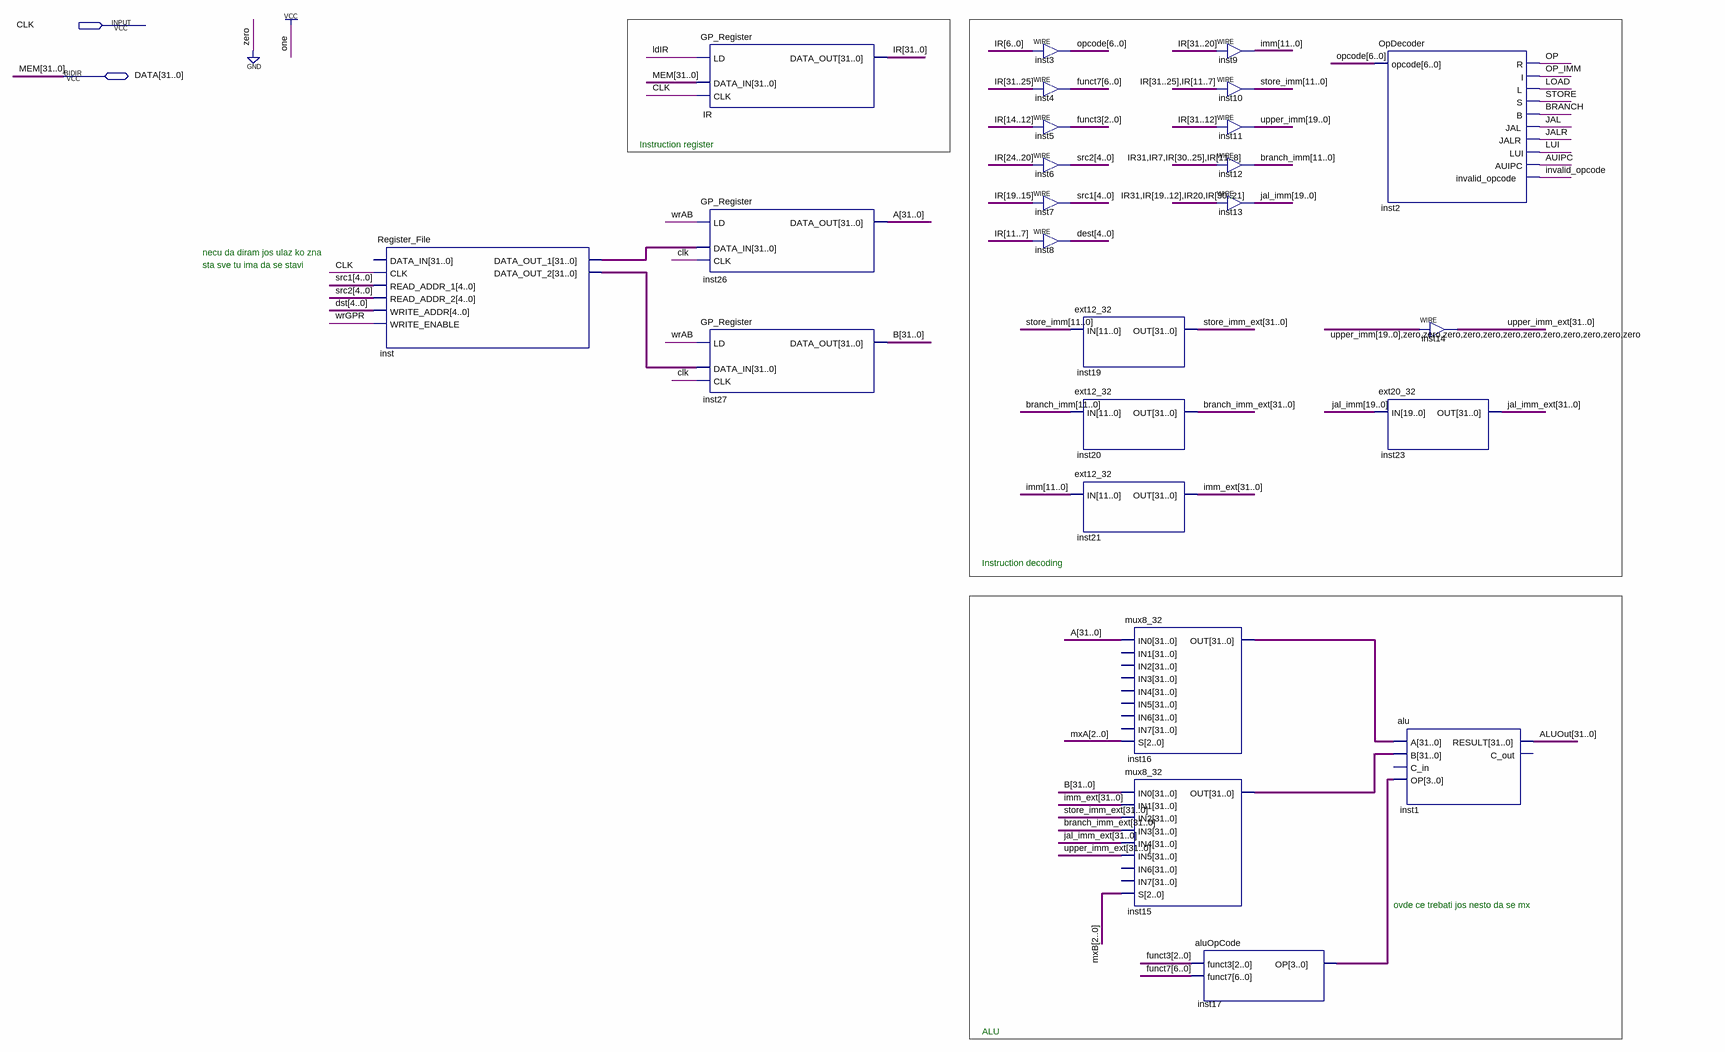
[diagram p0: schematic sheet]
// Quartus schematic riscv_core.bdf as structural Verilog: 25 symbols, 2 pins
module riscv_core (
  input  CLK,
  inout  [31:0] DATA
);

  wire AUIPC, BRANCH, invalid_opcode, JAL, JALR, ldIR, LOAD, LUI, OP, OP_IMM, STORE, wrAB, wrGPR;
  wire [2:0] funct3, mxA, mxB;
  wire [3:0] inst17_op;
  wire [4:0] dest, dst, src1, src2;
  wire [6:0] funct7, opcode;
  wire [11:0] branch_imm, imm, store_imm;
  wire [19:0] jal_imm, upper_imm;
  wire [31:0] A, ALUOut, B, branch_imm_ext, imm_ext, inst15_out, inst16_out, inst_data_out_1,
       inst_data_out_2, IR, jal_imm_ext, store_imm_ext, upper_imm_ext;

  Register_File inst (
    .CLK(CLK), .READ_ADDR_1(src1), .READ_ADDR_2(src2), .WRITE_ADDR(dst), .WRITE_ENABLE(wrGPR),
    .DATA_OUT_1(inst_data_out_1), .DATA_OUT_2(inst_data_out_2));  // open: DATA_IN
  GP_Register u_IR (.LD(ldIR), .DATA_IN(DATA), .CLK(CLK), .DATA_OUT(IR));
  GP_Register inst26 (.LD(wrAB), .DATA_IN(inst_data_out_1), .CLK(CLK), .DATA_OUT(A));
  GP_Register inst27 (.LD(wrAB), .DATA_IN(inst_data_out_2), .CLK(CLK), .DATA_OUT(B));
  assign opcode = IR[6:0];  // WIRE inst3
  assign funct7 = IR[31:25];  // WIRE inst4
  assign funct3 = IR[14:12];  // WIRE inst5
  assign src2 = IR[24:20];  // WIRE inst6
  assign src1 = IR[19:15];  // WIRE inst7
  assign dest = IR[11:7];  // WIRE inst8
  ext12_32 inst19 (.IN(store_imm), .OUT(store_imm_ext));
  ext12_32 inst20 (.IN(branch_imm), .OUT(branch_imm_ext));
  ext12_32 inst21 (.IN(imm), .OUT(imm_ext));
  mux8_32 inst16 (.IN0(A), .S(mxA), .OUT(inst16_out));  // open: IN1, IN2, IN3, IN4, IN5, IN6, IN7
  mux8_32 inst15 (
    .IN0(B), .IN1(imm_ext), .IN2(store_imm_ext), .IN3(branch_imm_ext), .IN4(jal_imm_ext),
    .IN5(upper_imm_ext), .S(mxB), .OUT(inst15_out));  // open: IN6, IN7
  aluOpCode inst17 (.funct3(funct3), .funct7(funct7), .OP(inst17_op));
  assign imm = IR[31:20];  // WIRE inst9
  assign store_imm = {IR[31:25], IR[11:7]};  // WIRE inst10
  assign upper_imm = IR[31:12];  // WIRE inst11
  assign branch_imm = {IR[31], IR[7], IR[30:25], IR[11:8]};  // WIRE inst12
  assign jal_imm = {IR[31], IR[19:12], IR[20], IR[30:21]};  // WIRE inst13
  OpDecoder inst2 (
    .opcode(opcode), .R(OP), .I(OP_IMM), .L(LOAD), .S(STORE), .B(BRANCH), .JAL(JAL), .JALR(JALR), .LUI(LUI),
    .AUIPC(AUIPC), .invalid_opcode(invalid_opcode));
  ext20_32 inst23 (.IN(jal_imm), .OUT(jal_imm_ext));
  alu inst1 (.A(inst16_out), .B(inst15_out), .OP(inst17_op), .RESULT(ALUOut));  // open: C_in, C_out
  assign upper_imm_ext = {upper_imm, {12{1'b0}}};  // WIRE inst14

  // Other names for the same wires on the sheet: MEM[31:0] = DATA

  // Notes on the sheet:
  //   Instruction register
  //   necu da diram jos ulaz ko zna   
  //   sta sve tu ima da se stavi     
  //   Instruction decoding
  //   ovde ce trebati jos nesto da se mx
  //   ALU
endmodule
